# Altium schematic sheet DC-DC модуль -5V.SchDoc
size 209 x 297 mm; DocumentNumber: 5; SheetNumber: 5; SheetTotal: 11; ListNumber: 1
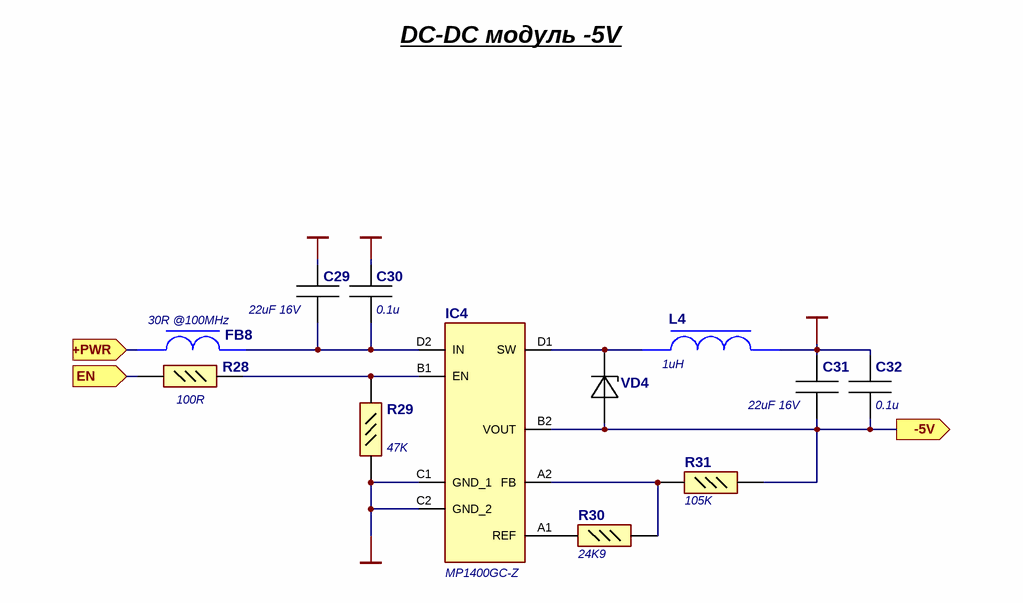
[diagram p0: DC-DC модуль -5V.SchDoc]

## Parts
C29  22uF 16V  [:CAP0805 C2012X125]
C30  0.1u  [:CAP0402 100x50x50]
C31  22uF 16V  [:CAP0805 C2012X125]
C32  0.1u  [:CAP0402 100x50x50]
FB8  30R @100MHz  [:FER BLM18SP300SN1D]
IC4  MP1400GC-Z  [:BGA8 CSP P2X4_80X160X63]
L4  1uH  [:IND1210 C3225]
R28  Manufacturer_Part_Number (part 2: value): 100R  [:RES0402]  (hidden comment: RC0402FR-07)
R29  Manufacturer_Part_Number (part 2: value): 47K  [:RES0402]  (hidden comment: RC0402FR-07)
R30  Manufacturer_Part_Number (part 2: value): 24K9  [:RES0402]  (hidden comment: RC0402FR-07)
R31  Manufacturer_Part_Number (part 2: value): 105K  [:RES0402]  (hidden comment: RC0402FR-07)
VD4  40V 1.5A  [:DIODE CST2C]  (value not drawn)

## Ports
+PWR (in), -5V (out), EN (in)

## Nets
GND: C29.2 C30.1 C31.2 C32.1 IC4.C1(GND_1) IC4.C2(GND_2) L4.2 R29.1
+PWR: FB8.1 ; port +PWR
-5V: C31.1 C32.2 IC4.B2(VOUT) R31.2 VD4.2(A) ; port -5V
EN: R28.1 ; port EN
NetC29_1: C29.1 C30.2 FB8.2 IC4.D2(IN)
NetIC4_A1: IC4.A1(REF) R30.1
NetIC4_A2: IC4.A2(FB) R30.2 R31.1
NetIC4_B1: IC4.B1(EN) R28.2 R29.2
NetIC4_D1: IC4.D1(SW) L4.1 VD4.1(K)

## Notes on the sheet
- DC-DC модуль -5V
- Подп. и дата
- Инв. № дубл.
- Взам. инв. №
- Инв. № подл.
- Лист
- Изм.
- № докум.
- Подп.
- Дата
- Копировал
- Формат А4

## Library data of the parts
C29 C31 = GRM21BR61C226ME44L: CAP CER 22uF 16V X5R; Manufacturer_Name: Murata Electronics; Short Description: 0805 22uF 16V; Datasheet Link: https://psearch.en.murata.com/capacitor/product/GRM21BR61C226ME44%23.html; Height: 1.45mm; Manufacturer_Part_Number: GRM21BR61C226ME44L; Mouser Part Number: 81-GRM21BR61C226ME4L; Mouser Price/Stock: https://www.mouser.co.uk/ProductDetail/Murata-Electronics/GRM21BR61C226ME44L?qs=H45D%252BQBid9ZSEksDj3jAIw%3D%3D; Arrow Part Number: GRM21BR61C226ME44L; Arrow Price/Stock: https://www.arrow.com/en/products/grm21br61c226me44l/murata-manufacturing
C30 C32 = GRM155R71E104KE14J: ±10% 25V Ceramic Capacitor X7R 0402 (1005 Metric); Manufacturer_Name: Murata Electronics; Short Description: 0402 0.1uF 25V; Datasheet Link: http://www.murata.com/~/media/webrenewal/support/library/catalog/products/capacitor/mlcc/c02e.pdf; Height: 0.55mm; Manufacturer_Part_Number: GRM155R71E104KE14J; Mouser Part Number: 81-GRM155R71E104KE4J; Mouser Price/Stock: https://www.mouser.co.uk/ProductDetail/Murata-Electronics/GRM155R71E104KE14J?qs=hNud%2FORuBR2EQtvG2InwAQ%3D%3D; Arrow Part Number: GRM155R71E104KE14J; Arrow Price/Stock: https://www.arrow.com/en/products/grm155r71e104ke14j/murata-manufacturing
FB8 = BLM18SP300SN1D: 30 Ohms @ 100MHz 1 Power Line Ferrite Bead 0603 (1608 Metric) 6A 8mOhm; Manufacturer_Name: Murata Electronics; Short Description: 0603 30R @100MHz; Datasheet Link: http://www.murata.com/~/media/webrenewal/support/library/catalog/products/emc/emifil/c31e.ashx?la=en-gb; Height: 0.95mm; Manufacturer_Part_Number: BLM18SP300SN1D; Mouser Part Number: 81-BLM18SP300SN1D; Mouser Price/Stock: https://www.mouser.co.uk/ProductDetail/Murata-Electronics/BLM18SP300SN1D/?qs=W%2FMpXkg%252BdQ4o%252BOP%252B6m8FYA%3D%3D
IC4 = MP1400GC-Z: DC/DC Converter / Input 2.7V...7V / Output -0.9V...-6V 600mA; Manufacturer_Name: Monolithic Power Systems (MPS); Short Description: -0.9...-6V; Datasheet Link: https://www.mouser.co.uk/datasheet/2/277/MP1400-1384079.pdf; Height: 0.63mm; Manufacturer_Part_Number: MP1400GC-Z
L4 = 74479299210: 1uH Shielded Molded Inductor 3A 46mOhm Max 1210 (3225 Metric) / Current - Saturation (Isat) 5.2A / Current Rating (Amps) 3A / Frequency - Self Resonant 50MHz; Manufacturer_Name: Würth Elektronik; Short Description: 1uH 3A 46mOhm; Manufacturer_Part_Number: 74479299210
R28-R31 = RC0402FR-07: Resistor 0402 1% 1/16W / Value Range: 1Ω ... 10 MΩ / Value Example: / 0R = 0Ω / 97R6 = 97.6Ω / 9K76 = 9760Ω / 1M = 1,000,000Ω; Manufacturer_Name: YAGEO; Manufacturer_Part_Number (part 3: after value): L; Short Description: 0402 1%; Datasheet Link: http://www.yageo.com/documents/recent/PYu-RC0402_51_RoHS_L_6_r.pdf; Height: 0.4mm; Manufacturer_Part_Number: RC0402FR-07; Parameter 1: *
VD4 = CCS15S40,L3F: Diode Schottky 40V 1.5A / @If 550mV @ 1.5A / @Vr 200µA @ 40V; Manufacturer_Name: Toshiba; Short Description: 0603 40V 1.5A; Manufacturer_Part_Number: CCS15S40,L3F